# Altium project NyiriLevente_29.PrjPcb
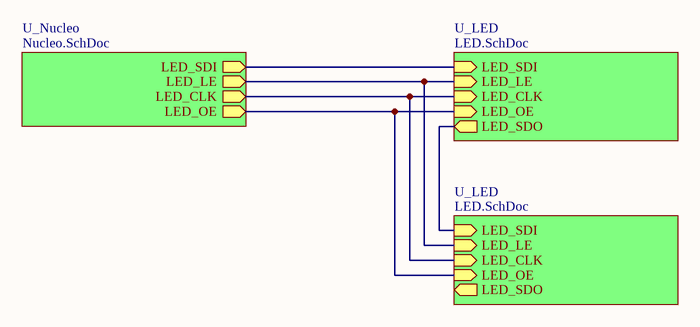
[diagram p0: MainSheet.SchDoc]
3 sheets, 40 parts. Net scope: hierarchical (ports join the sheet entries above them; power ports are global).
Board file: Nyiri_Levente.PcbDoc
Sheets:
  MainSheet.SchDoc
    U_Nucleo = Nucleo.SchDoc
    U_LED = LED.SchDoc
    U_LED = LED.SchDoc

## Sheet MainSheet.SchDoc: Persistence of Vision
size A4; Author: Nyiri Levente; Organization: BME_AUT; DocumentNumber: 1; Revision: 29; SheetNumber: 1; SheetTotal: 3

### Sub-sheets
U_LED = LED.SchDoc: LED_OE (in), LED_LE (in), LED_CLK (in), LED_SDI (in), LED_SDO (out)
U_LED = LED.SchDoc: LED_OE (in), LED_LE (in), LED_CLK (in), LED_SDI (in), LED_SDO (out)
U_Nucleo = Nucleo.SchDoc: LED_OE (out), LED_LE (out), LED_SDI (out), LED_CLK (out)

### Nets
LED_CLK: sheet U_Nucleo/LED_CLK, sheet U_LED/LED_CLK, sheet U_LED/LED_CLK
LED_LE: sheet U_Nucleo/LED_LE, sheet U_LED/LED_LE, sheet U_LED/LED_LE
LED_OE: sheet U_Nucleo/LED_OE, sheet U_LED/LED_OE, sheet U_LED/LED_OE
LED_SDI: sheet U_Nucleo/LED_SDI, sheet U_LED/LED_SDI
LED_SDI: sheet U_LED/LED_SDO, sheet U_LED/LED_SDI  [a separate net that carries the same name]

### Notes on the sheet
- Title
- Size:
- Date:
- A4
- Number:
- Time:
- Revision:
- Sheet
- of
- File:

## Sheet Nucleo.SchDoc: Persistence of Vision
size A4; Author: Nyiri Levente; Organization: BME_AUT; DocumentNumber: 2; Revision: 29; SheetNumber: 2; SheetTotal: 3
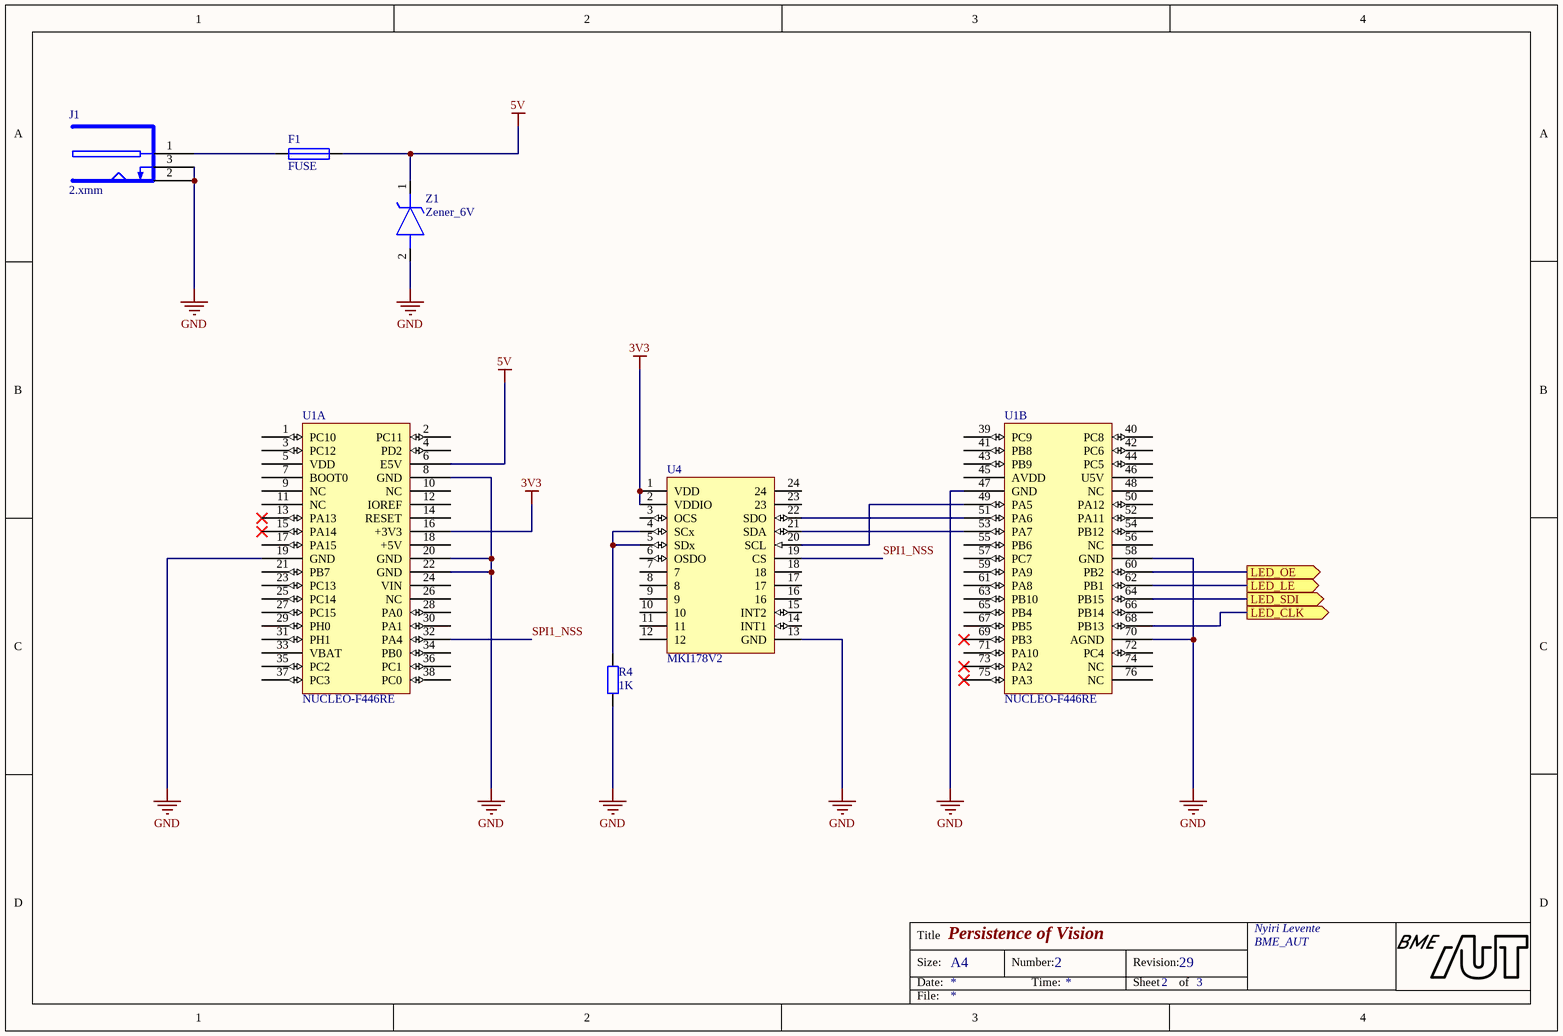
[diagram p1: Nucleo.SchDoc]

### Parts
F1  FUSE  [1812L125/16DR2.0]
J1  2.xmm  [FP_DC_TAP_ANYA]
R4  1K  [FP_0805_RES]
U1  NUCLEO-F446RE  [FP_NUCLEO-64_2x20]  (parts A,B of 2)
U4  MKI178V2  [FP_DIL24]
Z1  Zener_6V  [SOD2512X115N]

### Ports
LED_CLK (out), LED_LE (out), LED_OE (out), LED_SDI (out)

### Nets
3V3: U1.16(+3V3) U4.1(VDD) U4.2(VDDIO)
5V: F1.2 U1.6(E5V) Z1.1(K)
GND: J1.2(SLEEVE) J1.3(BREAK) R4.1 U1.8(GND) U1.19(GND) U1.20(GND) U1.22(GND) U1.47(GND) U1.58(GND) U1.70(AGND) U4.13(GND) Z1.2(A)
LED_CLK: U1.68(PB13) ; port LED_CLK
LED_LE: U1.62(PB1) ; port LED_LE
LED_OE: U1.60(PB2) ; port LED_OE
LED_SDI: U1.64(PB15) ; port LED_SDI
SPI1_NSS: U1.32(PA4) U4.19(CS)
NetF1_1: F1.1 J1.1(PIN)
NetR4_2: R4.2 U4.4(SCx) U4.5(SDx)
NetU1_49: U1.49(PA5) U4.20(SCL)
NetU1_51: U1.51(PA6) U4.22(SDO)
NetU1_53: U1.53(PA7) U4.21(SDA)

Not connected (* = marked no-connect by the designer): U1 1(PC10) 2(PC11) 3(PC12) 4(PD2) 5(VDD) 7(BOOT0) 9(NC) 10(NC) 11(NC) 12(IOREF) 13(PA13)* 14(RESET) 15(PA14)* 17(PA15) 18(+5V) 21(PB7) 23(PC13) 24(VIN) 25(PC14) 26(NC) 27(PC15) 28(PA0) 29(PH0) 30(PA1) 31(PH1) 33(VBAT) 34(PB0) 35(PC2) 36(PC1) 37(PC3) 38(PC0) 39(PC9) 40(PC8) 41(PB8) 42(PC6) 43(PB9) 44(PC5) 45(AVDD) 46(U5V) 48(NC) 50(PA12) 52(PA11) 54(PB12) 55(PB6) 56(NC) 57(PC7) 59(PA9) 61(PA8) 63(PB10) 65(PB4) 66(PB14) 67(PB5) 69(PB3)* 71(PA10) 72(PC4) 73(PA2)* 74(NC) 75(PA3)* 76(NC); U4 3(OCS) 6(OSDO) 7 8 9 10 11 12 14(INT1) 15(INT2) 16 17 18 23 24

### Notes on the sheet
- Title
- Size:
- Date:
- A4
- Number:
- Time:
- Revision:
- Sheet
- of
- File:

### Library data of the parts
F1 = 1812L125/16DR: PTC Resettable Fuse, 16V, Surface Mount; ComponentLink1URL: https://datasheet.ciiva.com:443/pdfs/VipMasterIC/IC/LFSI/LFSI-S-A0007892087/LFSI-S-A0007892087-1.pdf?src-supplier=IHS+Markit; ComponentLink1Description: https://datasheet.ciiva.com:443/pdfs/VipMasterIC/IC/LFSI/LFSI-S-A0007892087/LFSI-S-A0007892087-1.pdf?src-supplier=IHS+Markit; ComponentLink2URL: https://datasheet.ciiva.com/12541/littelfuse-ptc-1812l-12541791.pdf?src-supplier=Mouser; ComponentLink2Description: https://datasheet.ciiva.com/12541/littelfuse-ptc-1812l-12541791.pdf?src-supplier=Mouser; ComponentLink3URL: https://datasheet.ciiva.com/1273/48544-1273746.pdf?src-supplier=Element14; ComponentLink3Description: https://datasheet.ciiva.com/1273/48544-1273746.pdf?src-supplier=Element14; ComponentLink4URL: https://datasheet.ciiva.com/326/littelfuse-ptc-1812l-326975.pdf?src-supplier=Digikey; ComponentLink4Description: https://datasheet.ciiva.com/326/littelfuse-ptc-1812l-326975.pdf?src-supplier=Digikey; ComponentLink5URL: https://datasheet.ciiva.com/326/littelfuse-ptc-1812l-326976.pdf?src-supplier=Digikey; ComponentLink5Description: https://datasheet.ciiva.com/326/littelfuse-ptc-1812l-326976.pdf?src-supplier=Digikey; ComponentLink6URL: https://datasheet.ciiva.com/326/littelfuse-ptc-1812l-326977.pdf?src-supplier=Digikey; ComponentLink6Description: https://datasheet.ciiva.com/326/littelfuse-ptc-1812l-326977.pdf?src-supplier=Digikey; Supplier: Lomex; Reference: 44-04-71; Name: 1812L125/16DR
J1 = DC_TAP_ANYA: 2.xmm DC HEBA25 TÁPFESZÜLTSÉG ALJZAT ZÁRT, NYÁKBA 90°; Name: TÁP DC ANYA 5.5/2.1/9.5mm DCS-5521-5; Supplier: Lomex; Reference: 43-07-67
R4 = RES: Resistor; Name: CR-05JL7; Supplier: Lomex; Reference: 81-10-87
U1 = NUCLEO-F446RE: Reference: NUCLEO; Name: Nucleo F446RE; Supplier: Tanszék
U4 = MKI160V1: LSM6DS3 inertial module adapter; Reference: Tanszék; Name: MKI178V2; Supplier: ST
Z1 = BZT52C6V2S: Zener Diode; Supplier: Lomex; Reference: 85-02-89; Name: BZT52C6V2S

## Sheet LED.SchDoc: Persistence of Vision
size A4; Author: Nyiri Levente; Organization: BME_AUT; DocumentNumber: 3; Revision: 29; SheetNumber: 3; SheetTotal: 3
Used 2 times, as channels U_LED, U_LED. Parts and nets are listed once, with the designators drawn on the sheet.
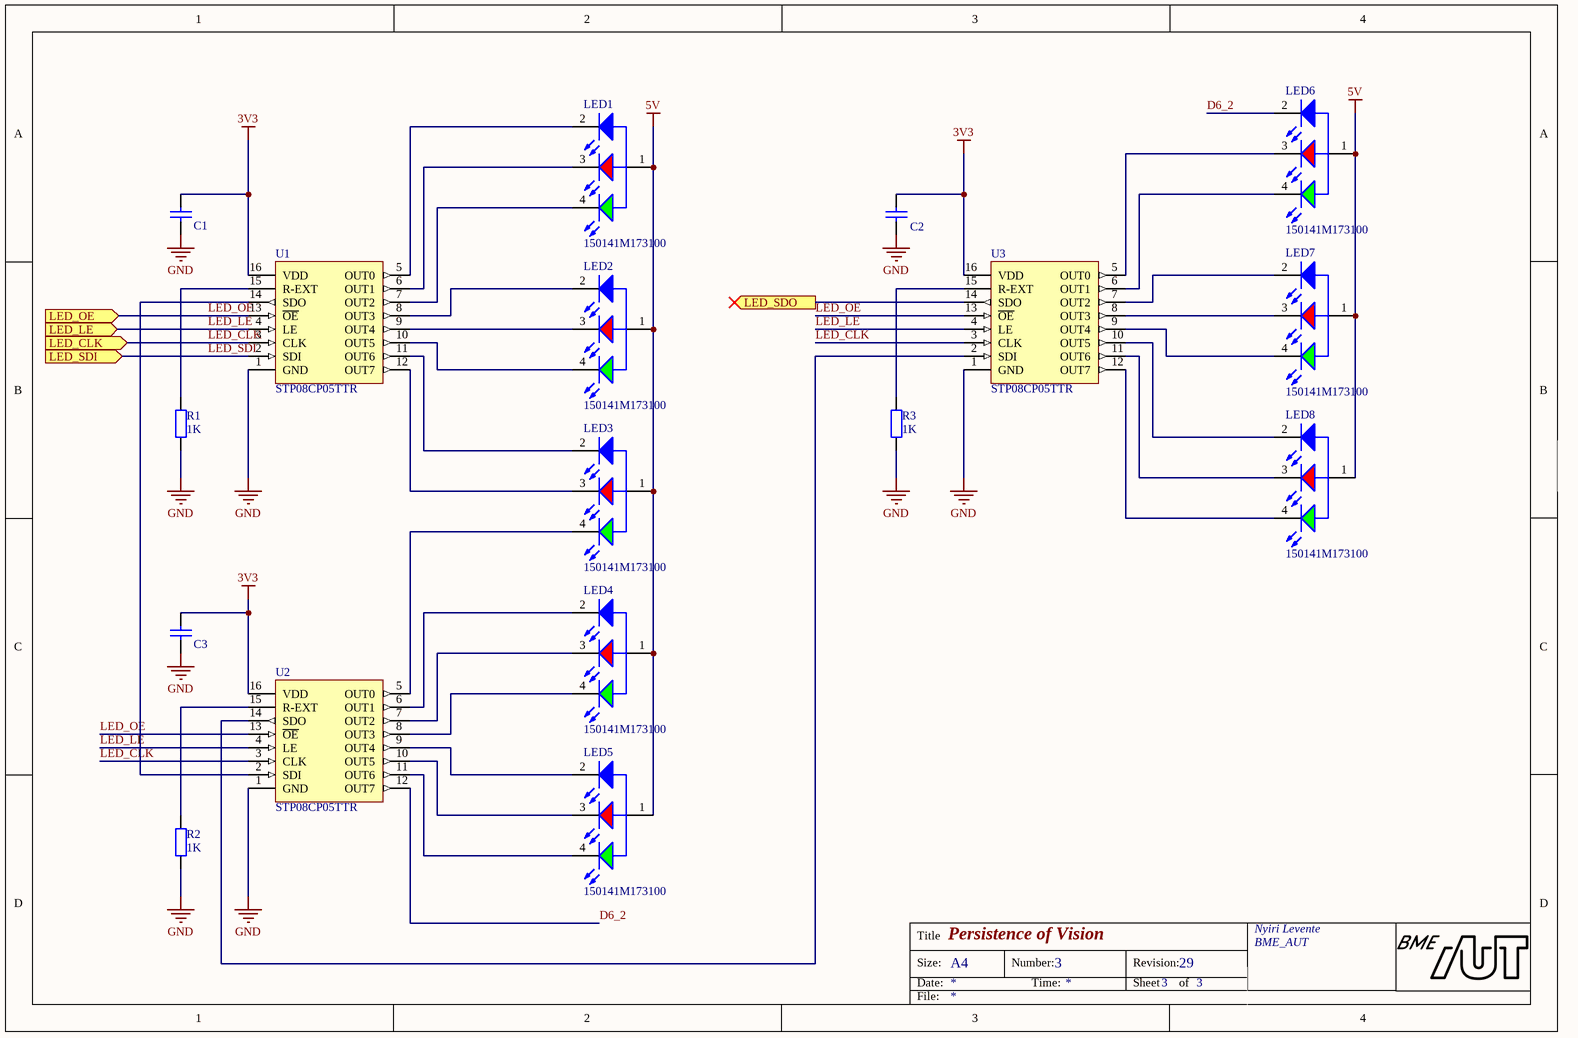
[diagram p2: LED.SchDoc]

### Parts
C1  100nF  [FP_0805_CAP_085]  (value not drawn)
C2  100nF  [FP_0805_CAP_085]  (value not drawn)
C3  100nF  [FP_0805_CAP_085]  (value not drawn)
LED1  150141M173100  [150141M173100]
LED2  150141M173100  [150141M173100]
LED3  150141M173100  [150141M173100]
LED4  150141M173100  [150141M173100]
LED5  150141M173100  [150141M173100]
LED6  150141M173100  [150141M173100]
LED7  150141M173100  [150141M173100]
LED8  150141M173100  [150141M173100]
R1  1K  [FP_0805_RES]
R2  1K  [FP_0805_RES]
R3  1K  [FP_0805_RES]
U1  STP08CP05TTR  [TSOP65P640X120-16M]
U2  STP08CP05TTR  [TSOP65P640X120-16M]
U3  STP08CP05TTR  [TSOP65P640X120-16M]

### Ports
LED_CLK (in), LED_LE (in), LED_OE (in), LED_SDI (in), LED_SDO (out)

### Nets
3V3: C1.2 C2.2 C3.2 U1.16(VDD) U2.16(VDD) U3.16(VDD)
5V: LED1.1(A) LED2.1(A) LED3.1(A) LED4.1(A) LED5.1(A) LED6.1(A) LED7.1(A) LED8.1(A)
GND: C1.1 C2.1 C3.1 R1.1 R2.1 R3.1 U1.1(GND) U2.1(GND) U3.1(GND)
D6_2: LED6.2(K) U2.12(OUT7)
LED_CLK: U1.3(CLK) U2.3(CLK) U3.3(CLK) ; port LED_CLK
LED_LE: U1.4(LE) U2.4(LE) U3.4(LE) ; port LED_LE
LED_OE: U1.13(~{OE}) U2.13(~{OE}) U3.13(~{OE}) ; port LED_OE
LED_SDI: U1.2(SDI) ; port LED_SDI
LED_SDO: U3.14(SDO) ; port LED_SDO
NetLED1_2: LED1.2(K) U1.5(OUT0)
NetLED1_3: LED1.3(K) U1.6(OUT1)
NetLED1_4: LED1.4(K) U1.7(OUT2)
NetLED2_2: LED2.2(K) U1.8(OUT3)
NetLED2_3: LED2.3(K) U1.9(OUT4)
NetLED2_4: LED2.4(K) U1.10(OUT5)
NetLED3_2: LED3.2(K) U1.11(OUT6)
NetLED3_3: LED3.3(K) U1.12(OUT7)
NetLED3_4: LED3.4(K) U2.5(OUT0)
NetLED4_2: LED4.2(K) U2.6(OUT1)
NetLED4_3: LED4.3(K) U2.7(OUT2)
NetLED4_4: LED4.4(K) U2.8(OUT3)
NetLED5_2: LED5.2(K) U2.9(OUT4)
NetLED5_3: LED5.3(K) U2.10(OUT5)
NetLED5_4: LED5.4(K) U2.11(OUT6)
NetLED6_3: LED6.3(K) U3.5(OUT0)
NetLED6_4: LED6.4(K) U3.6(OUT1)
NetLED7_2: LED7.2(K) U3.7(OUT2)
NetLED7_3: LED7.3(K) U3.8(OUT3)
NetLED7_4: LED7.4(K) U3.9(OUT4)
NetLED8_2: LED8.2(K) U3.10(OUT5)
NetLED8_3: LED8.3(K) U3.11(OUT6)
NetLED8_4: LED8.4(K) U3.12(OUT7)
NetR1_2: R1.2 U1.15(R-EXT)
NetR2_2: R2.2 U2.15(R-EXT)
NetR3_2: R3.2 U3.15(R-EXT)
NetU1_14: U1.14(SDO) U2.2(SDI)
NetU2_14: U2.14(SDO) U3.2(SDI)

### Channels
U_LED: designators end in B; ports LED_CLK=LED_CLK LED_LE=LED_LE LED_OE=LED_OE LED_SDI=LED_SDI LED_SDO=LED_SDI
U_LED: designators end in A; ports LED_CLK=LED_CLK LED_LE=LED_LE LED_OE=LED_OE LED_SDI=LED_SDI LED_SDO=NetU3A_14

### Notes on the sheet
- Title
- Size:
- Date:
- A4
- Number:
- Time:
- Revision:
- Sheet
- of
- File:

### Library data of the parts
C1-C3 = CAP: Capacitor; Name: 0805B104K500NT; Supplier: Lomex; Reference: 82-13-46
LED1-LED8 = 150141M173100: LED; Name: FYLS-3528RGBC-CA; Supplier: Lomex; Reference: 95-03-52
R1-R3 = RES: Resistor; Name: CR-05JL7; Supplier: Lomex; Reference: 81-10-87
U1-U3 = STP08CP05TTR: Low voltage, low current power 8-bit shift register; Reference: Tanszék; Supplier: ST; Name: STP08CP05TTR

## Nets that join several sheets
3V3: Nucleo (U1.16 U4.1 U4.2), U_LED (6 pins), U_LED (6 pins)
5V: Nucleo (F1.2 U1.6 Z1.1), U_LED (8 pins), U_LED (8 pins)
GND: Nucleo (12 pins), U_LED (9 pins), U_LED (9 pins)
LED_CLK: Nucleo (U1.68), U_LED (U1B.3 U2B.3 U3B.3), U_LED (U1A.3 U2A.3 U3A.3)
LED_LE: Nucleo (U1.62), U_LED (U1B.4 U2B.4 U3B.4), U_LED (U1A.4 U2A.4 U3A.4)
LED_OE: Nucleo (U1.60), U_LED (U1B.13 U2B.13 U3B.13), U_LED (U1A.13 U2A.13 U3A.13)
LED_SDI: Nucleo (U1.64), U_LED (U1B.2)
LED_SDI: U_LED (U3B.14), U_LED (U1A.2)